# Altium schematic sheet Glasses.SchDoc
size A3
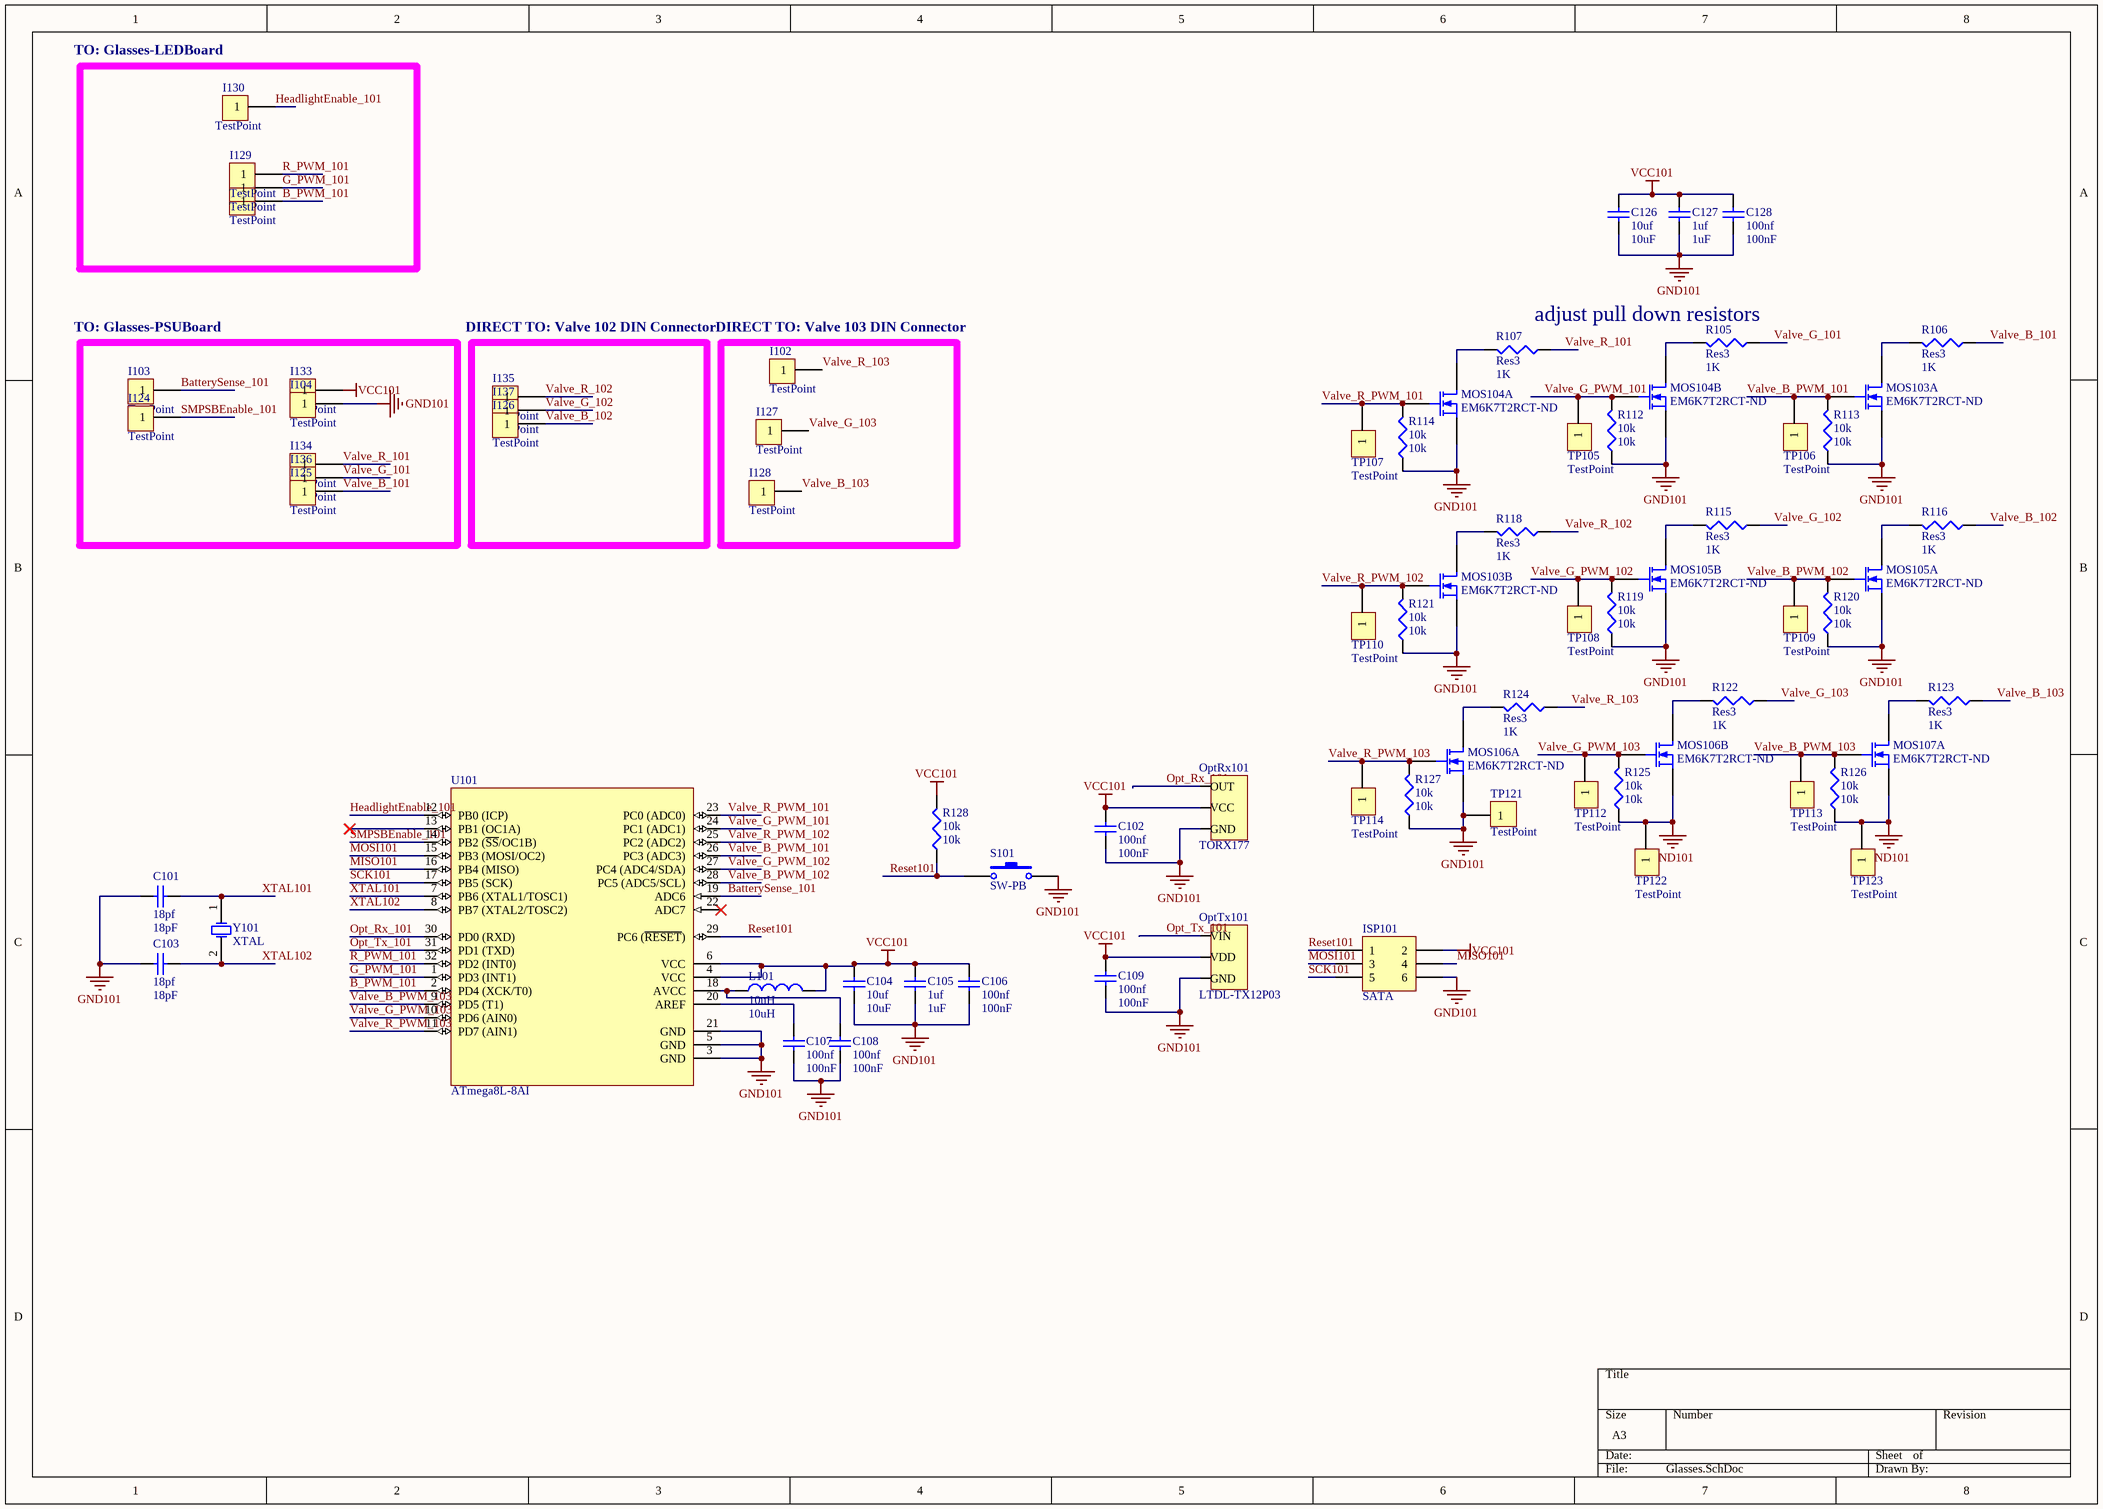
[diagram p0: Glasses.SchDoc]

## Parts
C101  18pf  [0603]
C102  100nf  [0603]
C103  18pf  [0603]
C104  10uf  [0805]
C105  1uf  [0603]
C106  100nf  [0603]
C107  100nf  [0603]
C108  100nf  [0603]
C109  100nf  [0603]
C126  10uf  [0805]
C127  1uf  [0603]
C128  100nf  [0603]
I102  TestPoint  [TestPoint]
I103  TestPoint  [TestPoint]
I104  TestPoint  [TestPoint]
I124  TestPoint  [TestPoint]
I125  TestPoint  [TestPoint]
I126  TestPoint  [TestPoint]
I127  TestPoint  [TestPoint]
I128  TestPoint  [TestPoint]
I129  TestPoint  [TestPoint]
I130  TestPoint  [TestPoint]
I131  TestPoint  [TestPoint]
I132  TestPoint  [TestPoint]
I133  TestPoint  [TestPoint]
I134  TestPoint  [TestPoint]
I135  TestPoint  [TestPoint]
I136  TestPoint  [TestPoint]
I137  TestPoint  [TestPoint]
ISP101  SATA  [SATA]
L101  10uH  [0805]
MOS103  EM6K7T2RCT-ND  [EM6K7T2R-EMT6]  (parts A,B of 2)
MOS104  EM6K7T2RCT-ND  [EM6K7T2R-EMT6]  (parts A,B of 2)
MOS105  EM6K7T2RCT-ND  [EM6K7T2R-EMT6]  (parts A,B of 2)
MOS106  EM6K7T2RCT-ND  [EM6K7T2R-EMT6]  (parts A,B of 2)
MOS107  EM6K7T2RCT-ND  [EM6K7T2R-EMT6]  (part A of 2)
OptRx101  TORX177  [Optical RX]
OptTx101  LTDL-TX12P03  [Optical TX]
R105  Res3  value 1K  [0805]
R106  Res3  value 1K  [0805]
R107  Res3  value 1K  [0805]
R112  10k  [0603]
R113  10k  [0603]
R114  10k  [0603]
R115  Res3  value 1K  [0805]
R116  Res3  value 1K  [0805]
R118  Res3  value 1K  [0805]
R119  10k  [0603]
R120  10k  [0603]
R121  10k  [0603]
R122  Res3  value 1K  [0805]
R123  Res3  value 1K  [0805]
R124  Res3  value 1K  [0805]
R125  10k  [0603]
R126  10k  [0603]
R127  10k  [0603]
R128  10k  [0603]
S101  SW-PB  [2 pin switch (surface mount)]
TP105  TestPoint  [TestPoint]
TP106  TestPoint  [TestPoint]
TP107  TestPoint  [TestPoint]
TP108  TestPoint  [TestPoint]
TP109  TestPoint  [TestPoint]
TP110  TestPoint  [TestPoint]
TP112  TestPoint  [TestPoint]
TP113  TestPoint  [TestPoint]
TP114  TestPoint  [TestPoint]
TP121  TestPoint  [TestPoint]
TP122  TestPoint  [TestPoint]
TP123  TestPoint  [TestPoint]
U101  ATmega8L-8AI  [ATMega_GOOD]
Y101  XTAL  [ABLS-16MHz-B4-T]

## Nets
GND101: C101.1 C102.1 C103.1 C104.1 C105.1 C106.1 C107.1 C108.1 C109.1 C126.1 C127.1 C128.1 I104.1 ISP101.6 MOS103.1(S) MOS103.4(S) MOS104.1(S) MOS104.4(S) MOS105.1(S) MOS105.4(S) MOS106.1(S) MOS106.4(S) MOS107.1(S) OptRx101.3(GND) OptTx101.3(GND) R112.1 R113.1 R114.1 R119.1 R120.1 R121.1 R125.1 R126.1 R127.1 S101.2 TP121.1 TP122.1 TP123.1 U101.3(GND) U101.5(GND) U101.21(GND)
VCC101: C102.2 C104.2 C105.2 C106.2 C109.2 C126.2 C127.2 C128.2 I133.1 ISP101.2 L101.2 OptRx101.2(VCC) OptTx101.2(VDD) R128.2 U101.4(VCC) U101.6(VCC)
B_PWM_101: I132.1 U101.2(PD4_(XCK/T0))
BatterySense_101: I103.1 U101.19(ADC6)
G_PWM_101: I131.1 U101.1(PD3_(INT1))
HeadlightEnable_101: I130.1 U101.12(PB0_(ICP))
MISO101: ISP101.4 U101.16(PB4_(MISO))
MOSI101: ISP101.3 U101.15(PB3_(MOSI/OC2))
Opt_Rx_101: OptRx101.1(OUT) U101.30(PD0_(RXD))
Opt_Tx_101: OptTx101.1(VIN) U101.31(PD1_(TXD))
R_PWM_101: I129.1 U101.32(PD2_(INT0))
Reset101: ISP101.1 R128.1 S101.1 U101.29(PC6_(~{RESET}))
SCK101: ISP101.5 U101.17(PB5_(SCK))
SMPSBEnable_101: I124.1 U101.14(PB2_(~{SS}/OC1B))
Valve_B_101: I125.1 R106.1
Valve_B_102: I126.1 R116.1
Valve_B_103: I128.1 R123.1
Valve_B_PWM_101: MOS103.2(G) R113.2 TP106.1 U101.26(PC3_(ADC3))
Valve_B_PWM_102: MOS105.2(G) R120.2 TP109.1 U101.28(PC5_(ADC5/SCL))
Valve_B_PWM_103: MOS107.2(G) R126.2 TP113.1 U101.9(PD5_(T1))
Valve_G_101: I136.1 R105.1
Valve_G_102: I137.1 R115.1
Valve_G_103: I127.1 R122.1
Valve_G_PWM_101: MOS104.5(G) R112.2 TP105.1 U101.24(PC1_(ADC1))
Valve_G_PWM_102: MOS105.5(G) R119.2 TP108.1 U101.27(PC4_(ADC4/SDA))
Valve_G_PWM_103: MOS106.5(G) R125.2 TP112.1 U101.10(PD6_(AIN0))
Valve_R_101: I134.1 R107.1
Valve_R_102: I135.1 R118.1
Valve_R_103: I102.1 R124.1
Valve_R_PWM_101: MOS104.2(G) R114.2 TP107.1 U101.23(PC0_(ADC0))
Valve_R_PWM_102: MOS103.5(G) R121.2 TP110.1 U101.25(PC2_(ADC2))
Valve_R_PWM_103: MOS106.2(G) R127.2 TP114.1 U101.11(PD7_(AIN1))
XTAL101: C101.2 U101.7(PB6_(XTAL1/TOSC1)) Y101.1(OSC1)
XTAL102: C103.2 U101.8(PB7_(XTAL2/TOSC2)) Y101.2(OSC2)
NetC107_2: C107.2 U101.20(AREF)
NetC108_2: C108.2 L101.1 U101.18(AVCC)
NetMOS103_3: MOS103.3(D) R118.2
NetMOS103_6: MOS103.6(D) R106.2
NetMOS104_3: MOS104.3(D) R105.2
NetMOS104_6: MOS104.6(D) R107.2
NetMOS105_3: MOS105.3(D) R115.2
NetMOS105_6: MOS105.6(D) R116.2
NetMOS106_3: MOS106.3(D) R122.2
NetMOS106_6: MOS106.6(D) R124.2
NetMOS107_6: MOS107.6(D) R123.2

Not connected (* = marked no-connect by the designer): U101 13(PB1_(OC1A))* 22(ADC7)*

## Notes on the sheet
- TO: Glasses-LEDBoard
- TO: Glasses-PSUBoard
- DIRECT TO: Valve 102 DIN Connector
- (near I102) DIRECT TO: Valve 103 DIN Connector
- adjust pull down resistors

## Library data of the parts
C101-C109 C126-C128 = Cap Semi: Capacitor (Semiconductor SIM Model); Published: 8-Jun-2000; LatestRevisionDate: 29-May-2009; LatestRevisionNote: IPC-7351 Footprint Added.; PackageReference: C1206; Publisher: Altium Limited; PackageDescription: Chip Capacitor
  C101 C103: Value: 18pF
  C102 C106-C109 C128: Value: 100nF
  C104 C126: Value: 10uF
  C105 C127: Value: 1uF
ISP101 = Header 3X2: Header, 3-Pin, Dual row; LatestRevisionDate: 17-Jul-2002; LatestRevisionNote: Re-released for DXP Platform.; Publisher: Altium Limited
L101 = Inductor: Code_IEC: 1005; Published: 8-Jun-2000; LatestRevisionDate: 29-May-2009; LatestRevisionNote: IPC-7351 Footprint Added.; PackageReference: 0402-A; Publisher: Altium Limited; PackageDescription: Chip Inductor; Code_JEITA: 0402; Value: 10uH
OptRx101 = TORX177: Optical receiver module
OptTx101 = LTDL-TX12P03: Optical transmitter
R105-R107 R112-R116 R118-R128 = Res3: Resistor; Published: 8-Jun-2000; LatestRevisionDate: 29-May-2009; LatestRevisionNote: IPC-7351 Footprint Added.; PackageReference: J1-0603; Publisher: Altium Limited; PackageDescription: Chip Resistor
  R112-R114 R119-R121 R125-R128: Value: 10k
S101 = SW-PB: Switch; Published: 24-Mar-1999; LatestRevisionDate: 17-Jul-2002; LatestRevisionNote: Re-released for DXP Platform.; PackageReference: SPST-2; Publisher: Altium Limited
U101 = ATmega8L-8AI: 8-Bit AVR Microcontroller with 8K Bytes of In-System Programmable Flash Memory; Published: 17-Sep-2003; LatestRevisionDate: 13-Apr-2006; LatestRevisionNote: IPC-7351 Footprint Added.; DatasheetVersion: 2486H-AVR-09/02; PackageVersion: revB, Oct-2001; PackageReference: 32A; Publisher: Altium Limited; PackageDescription: 32-Pin Thin Quad Flat Pack 0.8 mm Pitch; Code_JEDEC: MS-026-ABA; ComponentLink1Description: Manufacturer Link; ComponentLink1URL: http://www.atmel.com; ComponentLink2Description: Datasheet; ComponentLink2URL: http://www.atmel.com/dyn/resources/prod_documents/doc2486.pdf
Y101 = XTAL: Crystal Oscillator; Published: 8-Jun-2000; LatestRevisionDate: 17-Jul-2002; LatestRevisionNote: Re-released for DXP Platform.; PackageReference: R38; Publisher: Altium Limited
MOS103-MOS107 = EM6K7T2RCT-ND: Supplier 1: Digi-Key